# EAGLE design sensor_board_v0.6 (EAGLE 7.6.0)
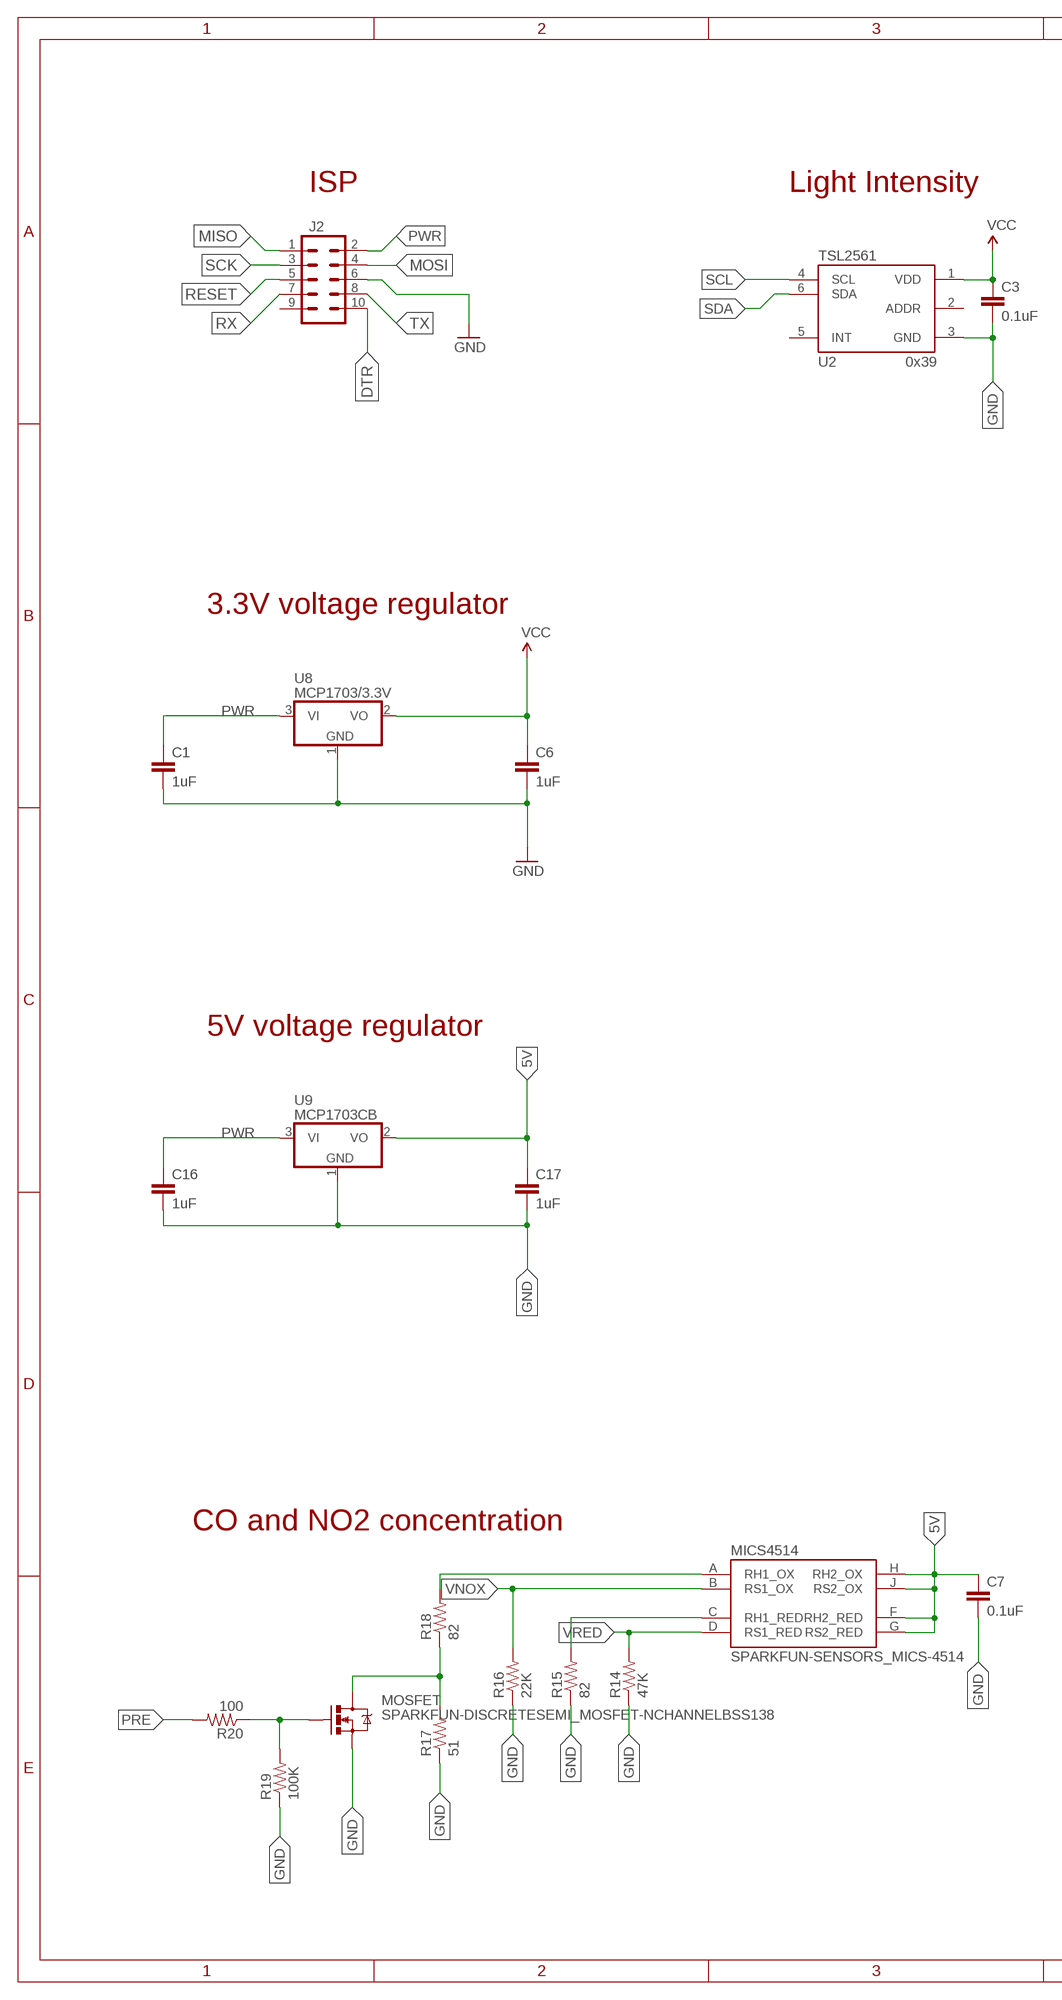
[diagram p0: schematic, sheet 1, part 1 of 2]
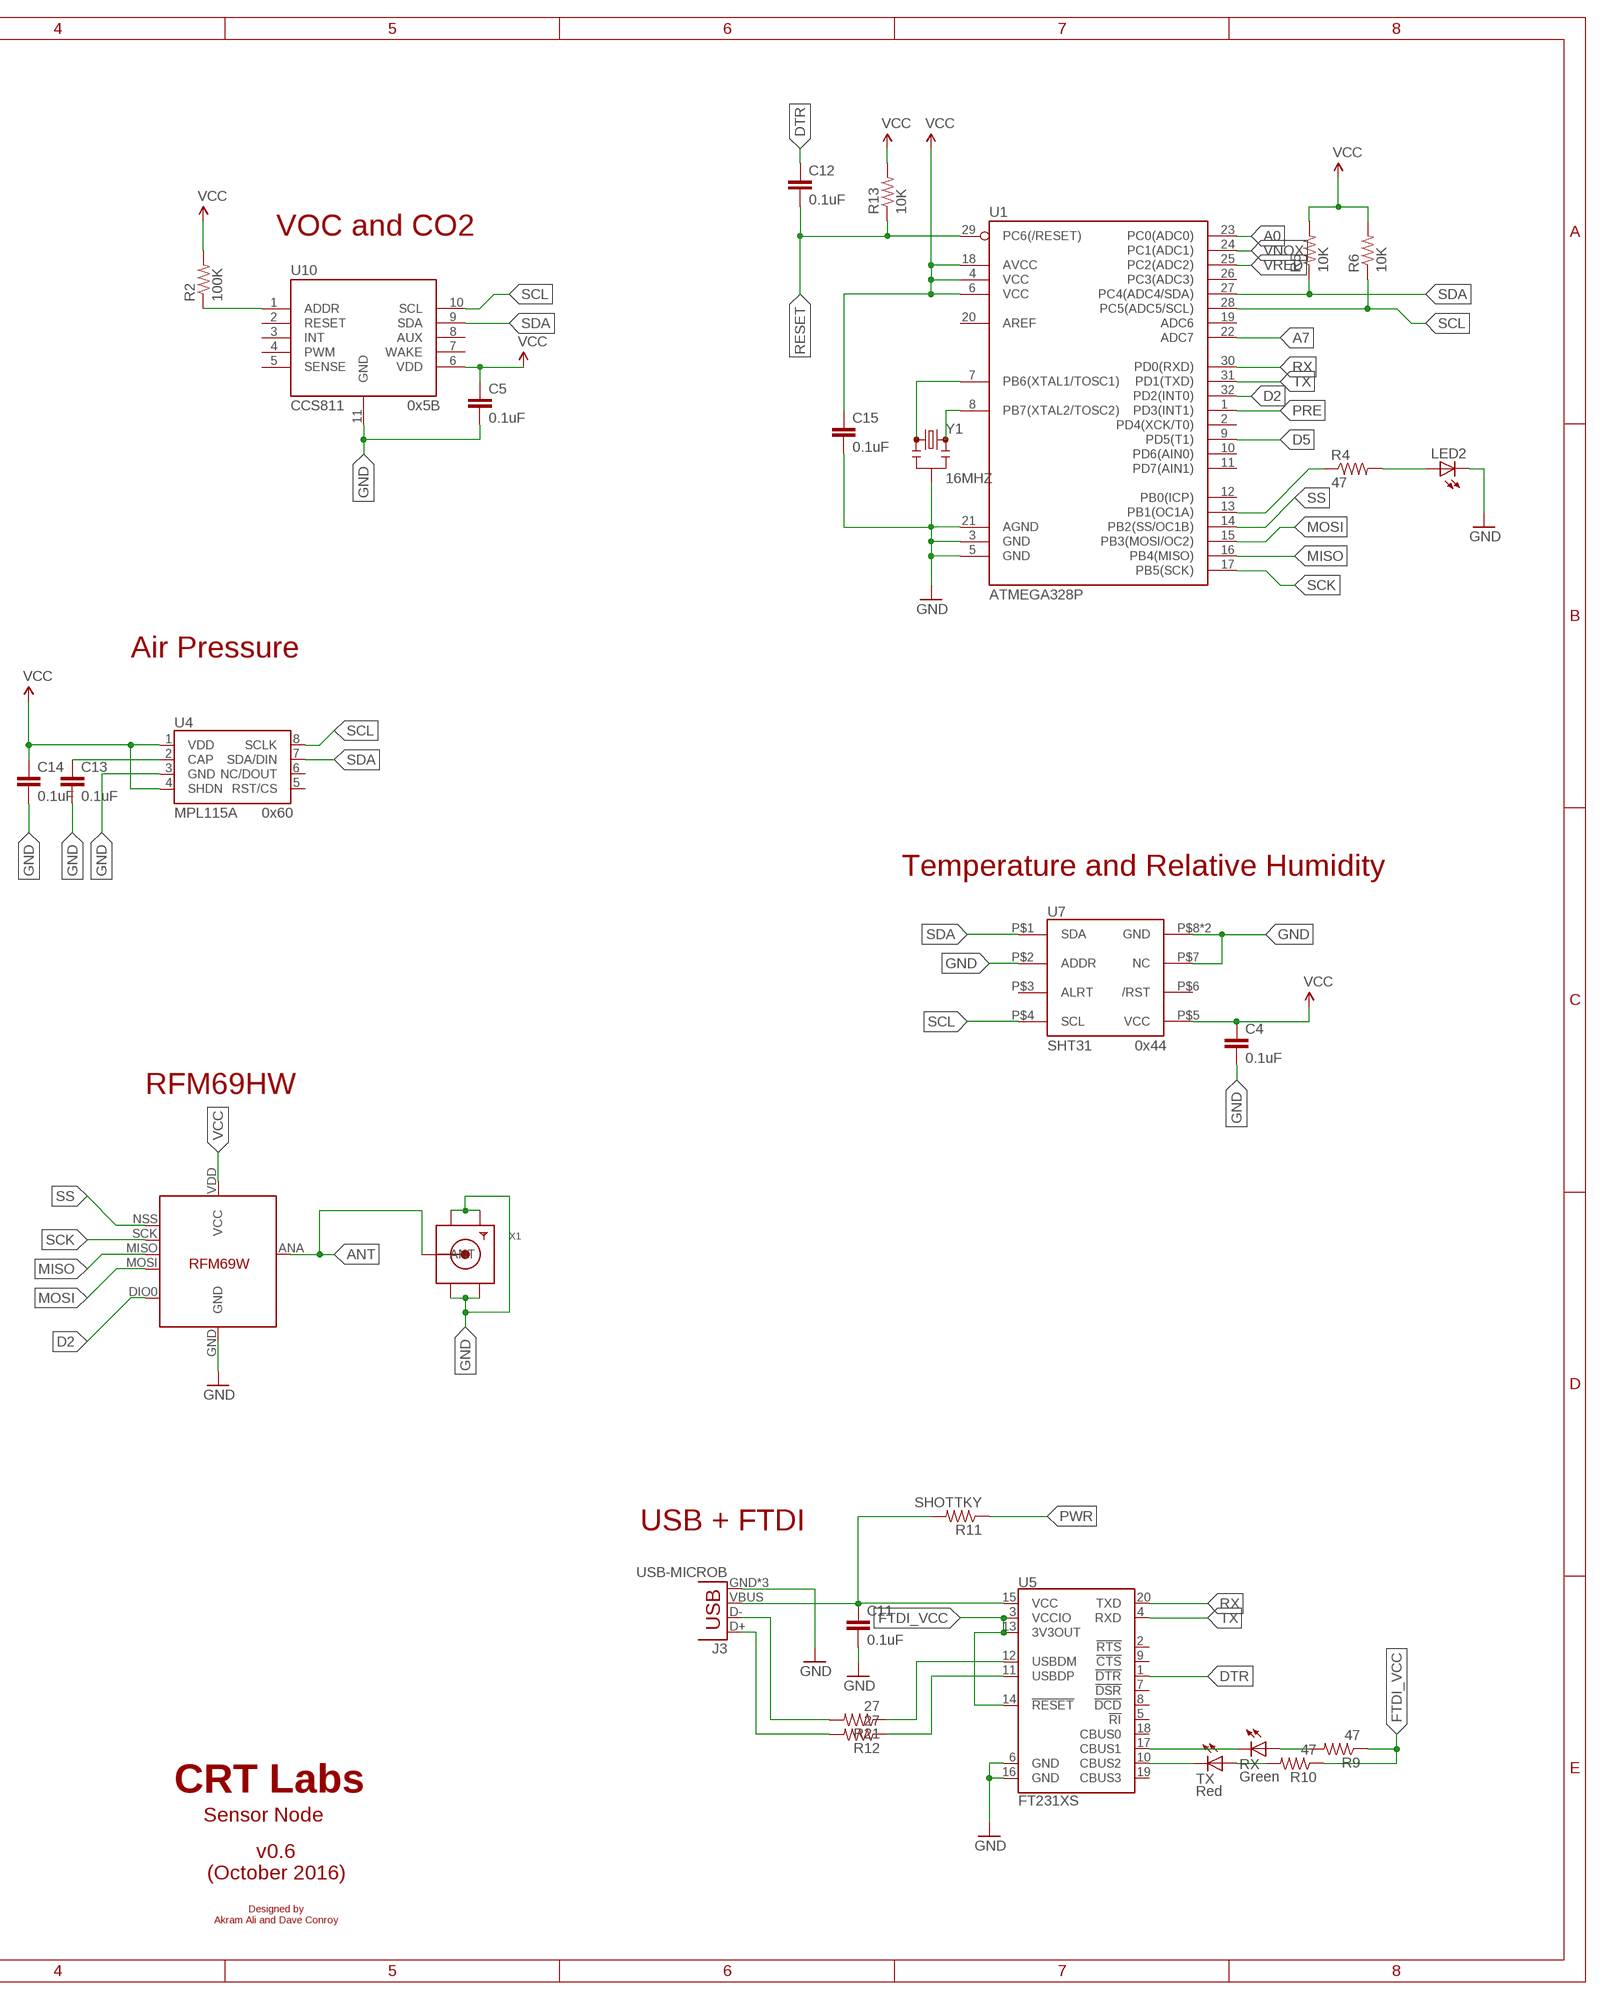
[diagram p1: schematic, sheet 1, part 2 of 2]

## Parts
C1  1uF  CAP0805  [0805]
C3  0.1uF  CAP0805  [0805]
C4  0.1uF  CAP0805  [0805]
C5  0.1uF  CAP0805  [0805]
C6  1uF  CAP0805  [0805]
C7  0.1uF  CAP0805  [0805]
C11  0.1uF  CAP0805  [0805]
C12  0.1uF  CAP0805  [0805]
C13  0.1uF  CAP0805  [0805]
C14  0.1uF  CAP0805  [0805]
C15  0.1uF  CAP0805  [0805]
C16  1uF  CAP0805  [0805]
C17  1uF  CAP0805  [0805]
J2  M05X2PTH  [AVR_ICSP]
J3  USB-MICROB  [USB-MICROB]
LED2  LEDCHIPLED_0805  [CHIPLED_0805]
MICS4514  SPARKFUN-SENSORS_MICS-4514  [SPARKFUN-SENSORS_MICS_10-SMD]
MOSFET  SPARKFUN-DISCRETESEMI_MOSFET-NCHANNELBSS138  [SPARKFUN-DISCRETESEMI_SOT23-3]
R2  100K  RESISTOR0805-RES  [0805]
R4  47  RESISTOR0805-RES  [0805]
R5  10K  RESISTOR0805-RES  [0805]
R6  10K  RESISTOR0805-RES  [0805]
R9  47  RESISTOR0805-RES  [0805]
R10  47  RESISTOR0805-RES  [0805]
R11  SHOTTKY  RESISTOR0805-RES  [0805]
R12  27  RESISTOR0805-RES  [0805]
R13  10K  RESISTOR0805-RES  [0805]
R14  47K  RESISTOR0805-RES  [0805]
R15  82  RESISTOR0805-RES  [0805]
R16  22K  RESISTOR0805-RES  [0805]
R17  51  RESISTOR0805-RES  [0805]
R18  82  RESISTOR0805-RES  [0805]
R19  100K  RESISTOR0805-RES  [0805]
R20  100  RESISTOR0805-RES  [0805]
R21  27  RESISTOR0805-RES  [0805]
RX  Green  LEDCHIPLED_0805  [CHIPLED_0805]
TX  Red  LEDCHIPLED_0805  [CHIPLED_0805]
U1  ATMEGA328P  ATMEGA328P_TQFP  [TQFP32-08]
U2  TSL2561  TSL2561FN  [FN-6]
U4  MPL115A  [LGA8]
U5  FT231XS  [SSOP20_L]
U7  SHT31  SHT31-DIS  [SHT3X]
U8  MCP1703/3.3V  MCP1703CB  [SOT23]
U9  MCP1703CB  [SOT23]
U10  CCS811  CCS811-I2C  [LGA]
U11  RFM69HW  LOWPOWERLAB_RFM69  [LOWPOWERLAB_RFM69W-MINPADS]
X1  SMACONNECTOR_EDGE  [SMA_EDGELAUNCH]
Y1  16MHZ  RESONATOR16MHZ  [RESONATOR-SMD]

## Nets
5V: C7.1 C17.1 MICS4514.F(RH2_RED) MICS4514.G(RS2_RED) MICS4514.H(RH2_OX) MICS4514.J(RS2_OX) U9.2(VO)
A0: U1.23(PC0(ADC0))
A7: U1.22(ADC7)
ANT: U11.ANA(ANT) X1.P(ANT)
D2: U1.32(PD2(INT0)) U11.DIO0
D5: U1.9(PD5(T1))
DTR: C12.1 J2.10 U5.1(!DTR)
FTDI_VCC: R9.1 R10.1 U5.3(VCCIO) U5.13(3V3OUT) U5.14(!RESET)
GND: C1.2 C3.2 C4.2 C5.2 C6.2 C7.2 C11.2 C13.2 C14.2 C15.2 C16.2 C17.2 J2.6 J3.GND J3.MT1(GND) J3.MT2(GND) LED2.C MOSFET.2(S) R14.1 R15.1 R16.1 R17.1 R19.1 U1.3(GND) U1.5(GND) U1.21(AGND) U2.3(GND) U4.3(GND) U5.6(GND) U5.16(GND) U7.P$2(ADDR) U7.P$7(NC) U7.P$8(GND) U7.PAD(GND) U8.1(GND) U9.1(GND) U10.11(GND) U11.GND X1.GND@1(GND4) X1.GND@2(GND3) X1.GND@3(GND2) X1.GND@4(GND1) Y1.2
MISO: J2.1 U1.16(PB4(MISO)) U11.MISO
MOSI: J2.4 U1.15(PB3(MOSI/OC2)) U11.MOSI
N$1: R2.1 U10.1(ADDR)
N$2: R4.1 U1.13(PB1(OC1A))
N$3: LED2.A R4.2
N$4: U1.8(PB7(XTAL2/TOSC2)) Y1.3
N$5: U1.7(PB6(XTAL1/TOSC1)) Y1.1
N$8: MICS4514.A(RH1_OX) R18.2
N$12: C13.1 U4.2(CAP)
N$13: MICS4514.C(RH1_RED) R15.2
N$17: RX.C U5.17(CBUS1)
N$18: TX.C U5.10(CBUS2)
N$20: MOSFET.3(D) R17.2 R18.1
N$23: MOSFET.1(G) R19.2 R20.1
N$25: R21.1 U5.12(USBDM)
N$26: R12.1 U5.11(USBDP)
N$27: R9.2 RX.A
N$29: R10.2 TX.A
N$32: J3.D- R21.2
N$33: J3.D+ R12.2
PRE: R20.2 U1.1(PD3(INT1))
PWR: C1.1 C16.1 J2.2 R11.1 U8.3(VI) U9.3(VI)
RESET: C12.2 J2.5 R13.1 U1.29(PC6(/RESET))
RX: J2.7 U1.30(PD0(RXD)) U5.20(TXD)
SCK: J2.3 U1.17(PB5(SCK)) U11.SCK
SCL: R6.1 U1.28(PC5(ADC5/SCL)) U2.4(SCL) U4.8(SCLK) U7.P$4(SCL) U10.10(SCL)
SDA: R5.1 U1.27(PC4(ADC4/SDA)) U2.6(SDA) U4.7(SDA/DIN) U7.P$1(SDA) U10.9(SDA)
SS: U1.14(PB2(SS/OC1B)) U11.NSS(SEL)
TX: J2.8 U1.31(PD1(TXD)) U5.4(RXD)
VBUS: C11.1 J3.VBUS R11.2 U5.15(VCC)
VCC: C3.1 C4.1 C5.1 C6.1 C14.1 C15.1 R2.2 R5.2 R6.2 R13.2 U1.4(VCC) U1.6(VCC) U1.18(AVCC) U2.1(VDD) U4.1(VDD) U4.4(SHDN) U7.P$5(VCC) U8.2(VO) U10.6(VDD) U11.VDD(VCC)
VNOX: MICS4514.B(RS1_OX) R16.2 U1.24(PC1(ADC1))
VRED: MICS4514.D(RS1_RED) R14.2 U1.25(PC2(ADC2))
Unconnected: J2.9 U1.2(PD4(XCK/T0)) U1.10(PD6(AIN0)) U1.11(PD7(AIN1)) U1.12(PB0(ICP)) U1.19(ADC6) U1.20(AREF) U1.26(PC3(ADC3)) U2.2(ADDR) U2.5(INT) U4.5(RST/CS) U4.6(NC/DOUT) U5.2(!RTS) U5.5(!RI) U5.7(!DSR) U5.8(!DCD) U5.9(!CTS) U5.18(CBUS0) U5.19(CBUS3) U7.P$3(ALRT) U7.P$6(/RST) U10.2(RESET) U10.3(INT) U10.4(PWM) U10.5(SENSE) U10.7(WAKE) U10.8(AUX)

## Notes on the sheet
- ISP | Light Intensity
- VOC and CO2
- 0x39
- 0x5B
- 3.3V voltage regulator
- Air Pressure
- 0x60
- Temperature and Relative Humidity
- 5V voltage regulator
- 0x44
- RFM69HW
- CO and NO2 concentration | USB + FTDI
- CRT Labs
- Sensor Node
- v0.6
  (October 2016)
- Designed by
  Akram Ali and Dave Conroy

## Library data of the parts
C1 C6 C11 C16 C17 = SparkFun-Capacitors:CAP: Capacitor Standard 0603 ceramic capacitor, and 0.1" leaded capacitor.; OC_NEWARK: unknown
C3-C5 C7 = SparkFun-Passives:CAP: Capacitor Standard 0603 ceramic capacitor, and 0.1" leaded capacitor.; OC_NEWARK: unknown
C12-C15 = SparkFun-Passives:CAP: Capacitor Standard 0603 ceramic capacitor, and 0.1" leaded capacitor.
J2 = SparkFun-Connectors:M05X2: Header 5x2 Standard 10-pin dual row 0.1" header. Commonly used with AVR-ISP. Use with Spark Fun Electronics SKU: PRT-00778
J3 = SparkFun-Connectors:USB: USB Connectors USB-B-PTH is fully proven SKU : PRT-00139/CONN-08278 USB-miniB is fully proven SKU : PRT-00587 USB-A-PCB is untested. USB-A-H is throughly reviewed, but untested. Spark Fun Electronics SKU : PRT-00437 USB-B-SMT is throughly reviewed, but untested. Needs silkscreen touching up. USB-A-S has not been used/tested USB-MB-H has not been used/tested USB-MICROB has been used. CONN-09505; PROD_ID: CONN-09505
LED2 RX TX = adafruit:LED: LED OSRAM: - CHIPLED LG R971, LG N971, LY N971, LG Q971, LY Q971, LO R971, LY R971 LH N974, LH R974 LS Q976, LO Q976, LY Q976 LO Q996 - Hyper CHIPLED LW Q18S LB Q993, LB Q99A, LB R99A - SideLED LS A670, LO A670, LY A670, LG A670, LP A670 LB A673, LV A673, LT A673, LW A673 LH A674 LY A675 LS A676, LA A676, LO A676, LY A676, LW A676 LS A679, LY A679, LG A679 - Hyper Micro SIDELED® LS Y876, LA Y876, LO Y876, LY Y876 LT Y87S - SmartLED LW L88C, LW L88S LB L89C, LB L89S, LG L890 LS L89K, LO L89K, LY L89K LS L896, LA L896, LO L896, LY L896 - TOPLED LS T670, LO T670, LY T670, LG T670, LP T670 LSG T670, LSP T670, LSY T670, LOP T670, LYG T670 LG T671, LOG T671, LSG T671 LB T673, LV T673, LT T673, LW T673 LH T674 LS T676, LA T676, LO T676, LY T676, LB T676, LH T676, LSB T676, LW T676 LB T67C, LV T67C, LT T67C, LS T67K, LO T67K, LY T67K, LW E67C LS E67B, LA E67B, LO E67B, LY E67B, LB E67C, LV E67C, LT E67C LW T67C LS T679, LY T679, LG T679 LS T770, LO T770, LY T770, LG T770, LP T770 LB T773, LV T773, LT T773, LW T773 LH T774 LS E675, LA E675, LY E675, LS T675 LS T776, LA T776, LO T776, LY T776, LB T776 LHGB T686 LT T68C, LB T68C - Hyper Mini TOPLED® LB M676 - Mini TOPLED Santana® LG M470 LS M47K, LO M47K, LY M47K Source: http://www.osram.convergy.de/; OC_NEWARK: unknown
MICS4514 = MICS-4514_CO_and_NOx_Sensor_Breakout:SPARKFUN-SENSORS_MICS-4514: Metal oxide MEMS carbon monoxide (CO) and NOx sensor in an SMD package.; PROD_ID: COMP-12310
MOSFET = MICS-4514_CO_and_NOx_Sensor_Breakout:SPARKFUN-DISCRETESEMI_MOSFET-NCHANNEL: Common NMOSFET Parts MFG P/N Store ID Prod ID FDD8780 TRANS-09984 SI7820DN TRANS-11055 FDS6630A IC-08089 2N7002PW TRANS-11151 FQP30N06L COM-10213 TRANS-10060 BSS123LT1G TRANS-08345 BSS138 TRANS-00830 BS170 2N7000; PROD_ID: TRANS-00830
R2 R9-R12 R14-R21 = SparkFun-Passives:RESISTOR: Resistor Basic schematic elements and footprints for 0603, 1206, and PTH resistors.; OC_NEWARK: unknown
R4-R6 = SparkFun-Resistors:RESISTOR: Resistor Basic schematic elements and footprints for 0603, 1206, and PTH resistors.; OC_NEWARK: unknown
R13 = SparkFun-Passives:RESISTOR: Resistor Basic schematic elements and footprints for 0603, 1206, and PTH resistors.
U1 = SparkFun-DigitalIC:ATMEGA328P_TQFP; MPN: ATMEGA328PB-AU; OC_NEWARK: 58Y6083; PROD_ID: IC-09069; VALUE: ATMEGA328P_TQFP
U2 = SparkFun-DigitalIC:TSL2561: TSL2561 illumination sensor Approximates Human Eye Response Precisely Measures Illuminance Programmable Interrupt Function with User-Defined Upper and Lower Threshold 400 KHz I2C interface Programmable Analog Gain and Integration Time Supporting 1,000,000-to-1 Dynamic Range Automatically Rejects 50/60-Hz Lighting Ripple Low Active Power (0.75 mW Typical) with Power Down Mode RoHS Compliant The TSL2561 is a light-to-digital converter that transform light intensity to a digital signal output via I2C interface. The device combines one broadband photodiode (visible plus infrared) and one infrared-responding photodiode on a single CMOS integrated circuit capable of providing a near-photopic response over an effective 20-bit dynamic range (16-bit resolution). Two integrating ADCs convert the photodiode currents to a digital output that represents the irradiance measured on each channel. This digital output can be input to a microprocessor where illuminance (ambient light level) in lux is derived using an empirical formula to approximate the human eye response. The TSL2561 device supports a traditional level style interrupt that remains asserted until the firmware clears it.; DIGIKEY#: TSL2561-FNCT-ND; MANF: AMS-TAOS-USA-Inc.; MANF#: TSL2561FN; MOUSER#: 856-TSL2561T; MPN: TSL2561FN; OC_NEWARK: 82Y5564; PROD_ID: IC-11791
U4 = SparkFun-Sensors:MPL115A: MPL115A1 (SPI) and MPL115A2 (I2C) Miniature Digital Barometer 5.0x3.0x1.2mm LGA Package
U5 = SparkFun-DigitalIC:FT231X: FTDI FT231X Full Speed USB to Full-handshake UART This USB2.0 Full Speed IC offers a compact bridge to full handshake UART interfaces. The device is a UART, capable of operating up to 3MBaud, with low power consumption (8mA). The FT231X includes the complete FT-X series feature set and enables USB to be added into a system design quickly and easily over a UART interface.; PROD_ID: IC-11524
U7 = thomasb9511:SHT31-DIS; MPN: SHT31-DIS-B; OC_NEWARK: 47Y1304
U8 U9 = linear:MCP1703: 250 mA, 16V, Low Quiescent Current LDO Regulator Source: http://ww1.microchip.com/downloads/en/DeviceDoc/22049b.pdf; MPN: MCP1703T-2502E/CB; OC_NEWARK: 18T9177
U10 = CCS811:CCS811
U11 = RFM69 USB Gateway:LOWPOWERLAB_RFM69
X1 = adafruit:SMACONNECTOR: SMA Connector 90° DIP SMA Connector, 50 Ohm (4UConnector: 07259)
Y1 = SparkFun-FreqCtrl:RESONATOR: Resonator Small SMD resonator. Used, eg, on the Arduino Pro/ Pro Mini boards. 8MHz- XTAL-08895 16MHz- XTAL-08900; OC_NEWARK: unknown; PROD_ID: XTAL-08900

## Board
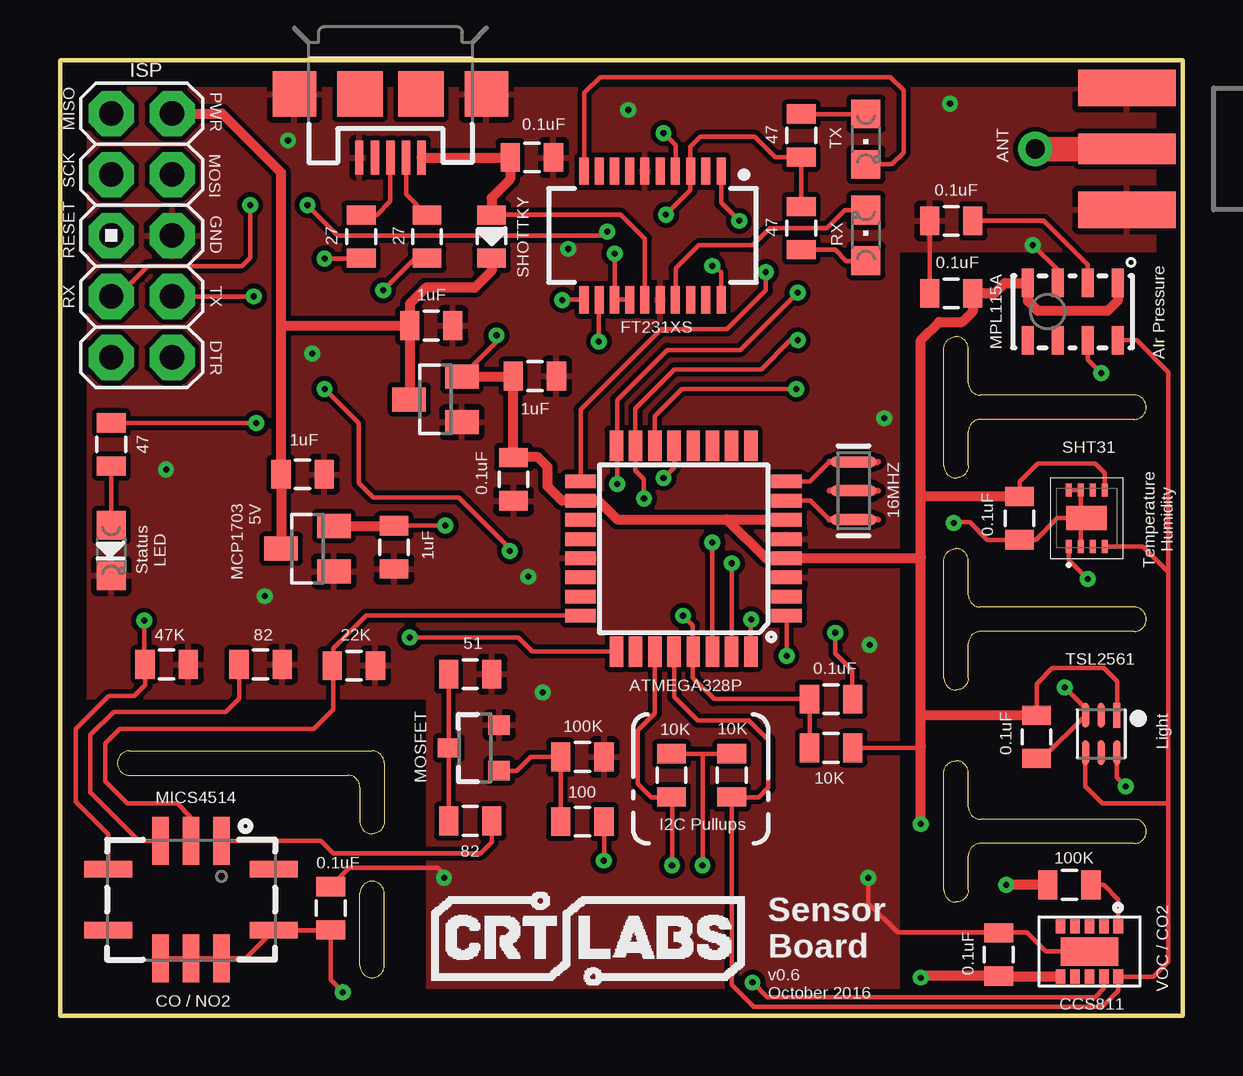
[diagram p2: board, top side]
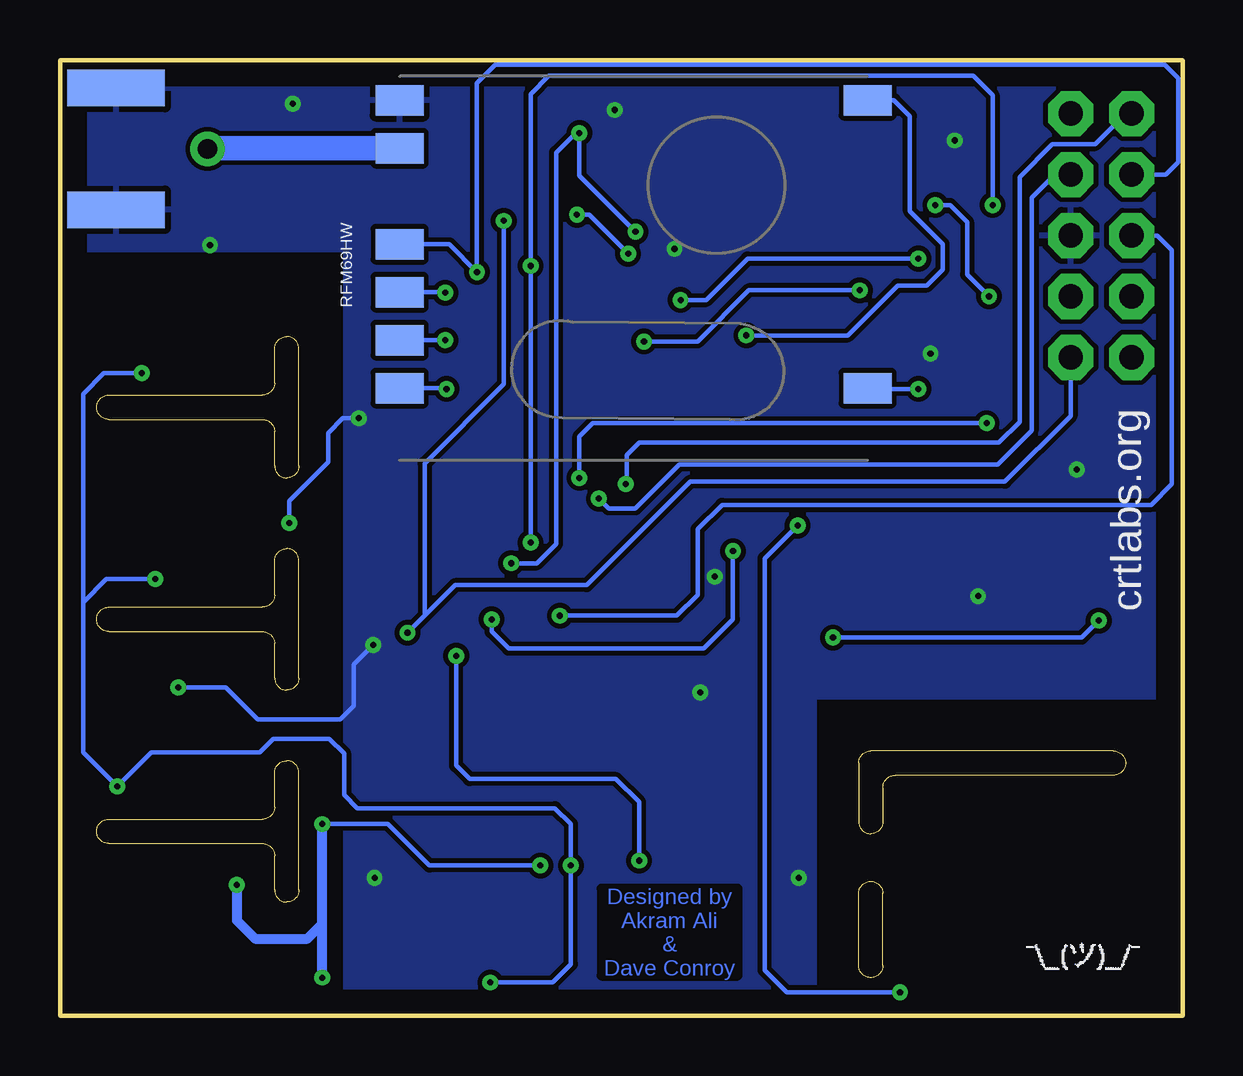
[diagram p3: board, bottom side, seen from below]

Size 46.79 x 39.85 mm. Coordinates in mm from the lower left corner, seen from the top.
Outline: 0.03,39.85 46.79,39.85 46.79,0 0,0 0,39.83
Outline: 44.76,8.2 38.35,8.2 arc-90 37.85,8.71 37.85,10.13 arc90 37.34,10.64 arc90 36.83,10.13 36.83,5.26 arc90 37.34,4.75 arc90 37.85,5.26 37.85,6.68 arc-90 38.35,7.19 44.76,7.19 arc90 45.26,7.7 arc90 44.76,8.2
Outline: 44.76,17.04 38.35,17.04 arc-90 37.85,17.55 37.85,18.97 arc90 37.34,19.48 arc90 36.83,18.97 36.83,14.1 arc90 37.34,13.59 arc90 37.85,14.1 37.85,15.52 arc-90 38.35,16.03 44.76,16.03 arc90 45.26,16.54 arc90 44.76,17.04
Outline: 44.76,25.88 38.35,25.88 arc-90 37.85,26.39 37.85,27.81 arc90 37.34,28.32 arc90 36.83,27.81 36.83,22.94 arc90 37.34,22.43 arc90 37.85,22.94 37.85,24.36 arc-90 38.35,24.87 44.76,24.87 arc90 45.26,25.37 arc90 44.76,25.88
Outline: 2.9,10.03 11.99,10.03 arc-90 12.5,9.52 12.5,8.1 arc90 13.01,7.59 arc90 13.51,8.1 13.51,10.54 arc90 13.01,11.05 2.9,11.05 arc90 2.39,10.54 arc90 2.9,10.03
Outline: 13.51,2.11 13.51,5.11 arc90 13.01,5.61 arc90 12.5,5.11 12.5,2.11 arc90 13.01,1.6 arc90 13.51,2.11
Copper layers (1*16): Top 0.035mm / dielectric 1.5mm / Bottom 0.035mm
Design rules "default": minimum track width 10mil, minimum drill 24mil, track to track 8mil, track to pad 8mil, pad to pad 8mil, via to via 8mil, smd to smd 8mil, copper to edge 40mil, drill to drill 8mil, minimum pad ring 10mil, minimum via ring 8mil, stop-mask expansion 4mil, vias tented up to drill 0mil, thermal gap 10mil

### Footprints (pad centres in the part's own frame; a part is rotated, then mirrored left to right if it is on the bottom)
0805 = smd 0.8 x 1.2: 1 -0.9,0; 2 0.9,0
AVR_ICSP = drill 1.016 pad 1.88 octagon: 1 -1.27,5.08; 2 1.27,5.08; 3 -1.27,2.54; 4 1.27,2.54; 5 -1.27,0; 6 1.27,0; 7 -1.27,-2.54; 8 1.27,-2.54; 9 -1.27,-5.08; 10 1.27,-5.08
USB-MICROB = smd 0.35 x 1.4: D+ 0,2.65; D- -0.65,2.65; GND 1.3,2.65; ID 0.65,2.65; VBUS -1.3,2.65 | smd 1.8 x 1.9: MT1 -4,0; MT2 4,0 | smd 1.9 x 1.9: P$1 -1.27,0; P$2 1.27,0
CHIPLED_0805 = smd 1.2 x 1.2: A 0,-1.05; C 0,1.05
SPARKFUN-SENSORS_MICS_10-SMD = smd 0.7 x 2: A 1.27,2.45; B 0,2.45; C -1.27,2.45; F -1.27,-2.45; G 0,-2.45; H 1.27,-2.45 | smd 2 x 0.7: D -3.45,1.27; E -3.45,-1.27; J 3.45,-1.27; K 3.45,1.27
SPARKFUN-DISCRETESEMI_SOT23-3 = smd 0.8 x 0.9: 1 -0.95,-1; 2 0.95,-1; 3 0,1.1
TQFP32-08 = smd 1.27 x 0.559: 1 -4.293,2.8; 2 -4.293,2; 3 -4.293,1.2; 4 -4.293,0.4; 5 -4.293,-0.4; 6 -4.293,-1.2; 7 -4.293,-2; 8 -4.293,-2.8; 17 4.293,-2.8; 18 4.293,-2; 19 4.293,-1.2; 20 4.293,-0.4; 21 4.293,0.4; 22 4.293,1.2; 23 4.293,2; 24 4.293,2.8 | smd 0.559 x 1.27: 9 -2.8,-4.293; 10 -2,-4.293; 11 -1.2,-4.293; 12 -0.4,-4.293; 13 0.4,-4.293; 14 1.2,-4.293; 15 2,-4.293; 16 2.8,-4.293; 25 2.8,4.293; 26 2,4.293; 27 1.2,4.293; 28 0.4,4.293; 29 -0.4,4.293; 30 -1.2,4.293; 31 -2,4.293; 32 -2.8,4.293
FN-6 = smd 1.05 x 0.3: 1 -0.775,0.65; 2 -0.775,0; 3 -0.775,-0.65; 4 0.775,-0.65; 5 0.775,0; 6 0.775,0.65
LGA8 = smd 1.2 x 0.5: 1 -1.2,1.875; 2 -1.2,0.625; 3 -1.2,-0.625; 4 -1.2,-1.875; 5 1.2,-1.875; 6 1.2,-0.625; 7 1.2,0.625; 8 1.2,1.875
SSOP20_L = smd 0.381 x 1.143: 1 -2.857,-2.68; 2 -2.223,-2.68; 3 -1.587,-2.68; 4 -0.953,-2.68; 5 -0.318,-2.68; 6 0.318,-2.68; 7 0.953,-2.68; 8 1.587,-2.68; 9 2.223,-2.68; 10 2.857,-2.68; 11 2.857,2.68; 12 2.223,2.68; 13 1.587,2.68; 14 0.953,2.68; 15 0.318,2.68; 16 -0.318,2.68; 17 -0.953,2.68; 18 -1.587,2.68; 19 -2.223,2.68; 20 -2.857,2.68
SHT3X = smd 0.55 x 0.25: P$1 -1.175,0.75; P$2 -1.175,0.25; P$3 -1.175,-0.25; P$4 -1.175,-0.75; P$5 1.175,-0.75; P$6 1.175,-0.25; P$7 1.175,0.25; P$8 1.175,0.75 | smd 1 x 1.7: PAD 0,0
SOT23 = smd 1 x 1.4: 1 -0.95,-1.1; 2 0.95,-1.1; 3 0,1.1
LGA = smd 0.6 x 0.4: 1 0.3,3.2; 2 0.3,2.6; 3 0.3,2; 4 0.3,1.4; 5 0.3,0.8; 6 2.4,0.8; 7 2.4,1.4; 8 2.4,2; 9 2.4,2.6; 10 2.4,3.2 | smd 1.2 x 2.4: 11 1.35,2
LOWPOWERLAB_RFM69W-MINPADS = smd 2 x 1.27: ANA 8,-5; DIO0 -11.5,5; GND 8,-7; MISO 8,1; MOSI 8,3; NSS 8,5; SCK 8,-1; VDD -11.5,-7
SMA_EDGELAUNCH = smd 4.064 x 1.524: GND@1 2.032,-2.54; GND@2 2.032,2.54 | smd 4.064 x 1.524 bottom: GND@3 2.032,2.54; GND@4 2.032,-2.54 | smd 4.064 x 1.27: P 2.032,0
RESONATOR-SMD = smd 0.45 x 1.905: 1 -1.2,0; 2 0,0; 3 1.2,0

### Placement (x,y rotation side)
C1  15.47,28.78 0 top
C3  40.69,11.63 270 top
C4  39.98,20.75 270 top
C5  39.12,2.57 90 top
C6  19.79,26.67 0 top
C7  11.28,4.5 90 top
C11  19.66,35.79 0 top
C12  32.13,13.21 180 top
C13  37.13,33.15 180 top
C14  37.13,30.12 180 top
C15  18.9,22.38 270 top
C16  10.11,22.58 0 top
C17  13.92,19.53 270 top
J2  3.4,32.54 0 top
J3  13.77,38.43 180 top
LED2  2.13,19.41 180 top
MICS4514  5.46,4.85 0 top
MOSFET  17.3,11.18 90 top
R2  42.06,5.46 180 top
R4  2.13,23.83 270 top
R5  25.48,10.03 90 top
R6  27.99,10.03 90 top
R9  30.89,32.84 270 top
R10  30.89,36.7 90 top
R11  17.98,32.49 90 top
R12  12.55,32.49 90 top
R13  32.13,11.18 0 top
R14  4.44,14.66 180 top
R15  8.36,14.66 180 top
R16  12.24,14.61 180 top
R17  17.09,14.25 180 top
R18  17.09,8.13 0 top
R19  21.77,10.79 180 top
R20  21.77,8.1 0 top
R21  15.29,32.49 90 top
RX  33.58,32.54 0 top
TX  33.58,36.55 180 top
U1  25.98,19.48 180 top
U2  43.38,11.76 270 top
U4  42.19,29.36 270 top
U5  24.69,32.54 180 top
U7  42.77,20.75 90 top
U8  15.65,25.7 90 top
U9  10.31,19.48 90 top
U10  40.89,4.04 270 top
U11  24.64,31.17 180 bottom
X1  46.48,36.14 180 top
Y1  33.07,21.89 90 top

### Tracks (layer width: path | path; a pad name or v marks a point on that pad's centre or on a via)
5V  (via drill 0.25 pad 0.13)
  Top 0.178: 8.89,3.56 MICS4514.J | MICS4514.F MICS4514.G MICS4514.H 7.73,2.4 MICS4514.J | MICS4514.J 11.26,3.58 C7.1 11.28,1.5 v11.79,0.99 | v16.05,20.45 13.93,20.45 C17.1
  Top 0.406: U9.2 C17.1
  Bottom 0.178: v11.79,0.99 16.51,0.99 17.42,1.9 17.42,19.08 v16.05,20.45
ANT  (via drill 0.8 pad 1.42)
  Top 1.016: X1.P v40.64,36.14
  Bottom 1.016: U11.ANA 40.62,36.17 v40.64,36.14
D2  (via drill 0.25 pad 0.13)
  Top 0.178: v18.75,19.38 18.75,19.48 16.61,21.62 13.06,21.62 12.45,22.22 12.45,24.71 v11.02,26.14 | v28.8,16.54 28.78,16.52 U1.32
  Bottom 0.178: v18.75,19.38 18.75,16.54 19.96,15.32 28.09,15.32 28.8,16.03 v28.8,16.54 | 13.16,26.15 U11.DIO0 13.11,26.14 v11.02,26.14
DTR  (via drill 0.25 pad 0.13)
  Top 0.178: U5.1 27.55,33.9 v28.3,33.15 | v32.31,15.98 32.31,15.11 33.02,14.4 C12.1
  Bottom 0.178: v28.3,33.15 28.3,26.34 31.6,23.04 31.6,16.69 | 31.6,16.69 31.78,16.51 v32.31,15.98 | J2.10 4.67,25.02 7.42,22.28 20.52,22.28 24.84,17.96 30.33,17.96 31.6,16.69
FTDI_VCC  (via drill 0.25 pad 0.13)
  Top 0.178: U5.14 U5.13 23.11,29.87 v23.11,31.78 | R9.1 R10.1 29.81,35.8 28.96,36.65 26.67,36.65 26.26,36.25 26.26,35.23 | 26.26,35.23 U5.3 | 26.26,35.23 26.26,34.42 v25.25,33.4
  Bottom 0.178: v25.25,33.4 24.74,33.4 v23.11,31.78
GND  (via drill 0.25 pad 0.13)
  Top 0.178: v16,5.77 16,5.92 15.75,6.17 12.05,6.17 C7.2 | U10.11 41.08,2.69 40.28,3.48 39.13,3.48 | 39.13,3.48 C5.2 | 39.13,3.48 34.9,3.48 33.68,4.7 v33.68,5.77 | U7.P$2 42.52,20.5 U7.PAD | U7.P$8 U7.P$7 42.52,21 U7.PAD | U7.PAD 41.55,20.75 40.65,19.85 C4.2 38.64,19.85 37.9,20.6 37.29,20.6 v37.24,20.55 | C3.2 40.93,10.73 U2.3 42.73,12.82 v41.86,13.69 | C14.2 C13.2 | U4.3 41.56,31.1 v40.54,32.13
  Bottom 0.178: v37.24,20.55 37.24,21.46 35.61,23.09 35.61,24.31 35,24.92 v34.34,24.92 | v33.73,15.47 34.54,14.66 34.54,12.93 35.1,12.37 38.56,12.37 39.88,13.69 v41.86,13.69
  other vias: 37.08,38.02 23.67,37.77 8.53,17.5 9.5,36.5 10.52,27.61 19.51,18.31 21.18,31.98 4.42,22.78 20.12,13.49
  pour Top: -0.41,40.31 47.19,40.31 47.19,31.93 34.9,31.93 34.9,-0.58 15.34,-0.58 15.34,13.28 -0.56,13.28 -0.56,40.26
  pour Bottom: -0.41,40.36 47.19,40.36 47.24,31.93 34.9,31.93 34.9,-0.79 15.34,-0.79 15.34,13.28 -0.56,13.28 -0.56,40.31
MISO  (via drill 0.25 pad 0.13)
  Top 0.178: v30.73,30.15 28.35,27.76 25.3,27.76 23.22,25.68 23.22,23.81 U1.16 23.22,23.74 v23.22,22.17
  Bottom 0.178: U11.MISO 30.75,30.17 v30.73,30.15 | J2.1 2.39,37.62 3.66,36.35 5.44,36.35 6.81,34.98 6.81,24.76 7.67,23.9 22.66,23.9 23.17,23.39 23.17,22.12 v23.22,22.17
MOSI  (via drill 0.25 pad 0.13)
  Top 0.178: v30.73,28.17 30.43,28.17 29.21,26.95 25.6,26.95 23.98,25.32 U1.15 23.98,22.73 24.33,22.38 v24.33,21.56
  Bottom 0.178: U11.MOSI v30.74,28.17 v30.73,28.17 | J2.4 5.33,35.08 6.3,34.11 6.3,24.41 7.72,22.99 20.98,22.99 22.81,21.16 23.93,21.16 v24.33,21.56
N$1
  Top 0.178: R2.1 43.49,5.46 44.09,4.85 U10.1 | U10.1
N$2  (via drill 0.25 pad 0.13)
  Top 0.178: U1.13 25.58,22.87 v25.15,22.43 | R4.1 8.17,24.73 v8.18,24.71
  Bottom 0.178: v25.15,22.43 25.15,24.16 24.59,24.71 v8.18,24.71
N$3
  Top 0.178: R4.2 LED2.A
N$4
  Top 0.178: U1.8 31.24,22.28 32.06,23.09
N$5
  Top 0.178: U1.7 31.27,21.48 32.06,20.69
N$8
  Top 0.178: MICS4514.A 10.86,7.3 11.38,6.78 17.53,6.78 17.98,7.24 17.98,8.12 R18.2
N$12
  Top 0.178: C13.1 41,33.15 42.82,31.32 42.82,30.57 U4.2
N$13
  Top 0.178: R15.2 7.47,14.64 7.47,13.23 6.91,12.67 2.24,12.67 1.27,11.71 1.27,9.32 3.29,7.3 MICS4514.C
N$17
  Top 0.178: RX.C 32.7,33.59 31.95,32.84 29.57,32.84 28.85,32.13 26.62,32.13 25.65,31.17 25.65,29.87 U5.17
N$18
  Top 0.178: TX.C 34.66,35.5 35.15,35.99 35.15,38.58 34.6,39.14 22.5,39.14 21.84,38.48 21.84,35.23 U5.10
N$20
  Top 0.178: R18.1 MOSFET.3 R17.2
N$23
  Top 0.178: MOSFET.1 19.04,10.23 19.61,10.79 R19.2 R20.1
N$25  (via drill 0.25 pad 0.13)
  Top 0.178: R21.1 14.8,31.59 v13.46,30.25 | v22.45,28.12 22.45,29.84 U5.12
  Bottom 0.178: v13.46,30.25 18.09,30.25 20.22,28.12 v22.45,28.12
N$26  (via drill 0.25 pad 0.13)
  Top 0.178: U5.11 20.94,29.86 v20.93,29.84 | v11.02,31.57 12.53,31.57 R12.1
  Bottom 0.178: v20.93,29.84 19.86,29.84 18.14,31.57 v11.02,31.57
N$27
  Top 0.178: R9.2 32.29,31.94 32.77,31.47 33.56,31.47 RX.A
N$29
  Top 0.178: TX.A R10.2
N$32
  Top 0.178: J3.D- 14.42,34.26 R21.2
N$33
  Top 0.178: R12.2 13.19,33.39 13.77,33.96 J3.D+
PRE  (via drill 0.25 pad 0.13)
  Top 0.178: R20.2 v22.67,6.49 v22.66,6.48 | v30.28,15.01 U1.1
  Bottom 0.178: v22.66,6.48 22.66,8.92 23.62,9.88 29.72,9.88 30.28,10.44 v30.28,15.01
PWR
  Top 0.406: R11.1 17.98,31.06 17.27,30.35 15.24,30.35 14.58,29.69 14.58,28.79 | 14.58,28.79 C1.1 9.21,28.78 | 14.58,28.79 14.58,25.74 U8.3 | U9.3 C16.1 9.21,28.78 | J2.2 6.76,37.62 9.21,35.16 9.21,28.78
RESET  (via drill 0.25 pad 0.13)
  Top 0.178: R13.1 C12.2 27.25,13.21 26.37,14.1 26.37,15.17 | 26.37,15.17 U1.29 | 26.37,15.17 26.37,16.28 v25.96,16.69
  Bottom 0.178: v25.96,16.69 21.08,16.69 20.22,17.55 20.22,20.29 19.2,21.31 1.32,21.31 0.46,22.17 0.46,31.93 1.07,32.54 J2.5
RX  (via drill 0.25 pad 0.13)
  Top 0.178: U5.20 27.55,31 v27.18,31.27 | U1.30 v27.18,19.73 v27.18,19.74 | J2.7 2.39,30 3.66,31.27 7.57,31.27 7.93,31.62 v7.93,33.81
  Bottom 0.178: v27.18,19.74 v27.18,31.27 27.18,38.43 26.42,39.19 8.74,39.19 7.93,38.38 v7.93,33.81
SCK  (via drill 0.25 pad 0.13)
  Top 0.178: U1.17 21.69,25.27 25.04,28.63 27.79,28.63 29.41,30.25 v29.41,31.01
  Bottom 0.178: U11.SCK 30.57,32.17 v29.41,31.01 29.41,38.89 28.65,39.65 0.76,39.65 0.2,39.09 0.2,35.59 0.71,35.08 J2.3
SCL
  Top 0.178: U1.28 25.58,13.3 26.57,12.32 28.7,12.32 29.52,11.51 29.52,9.52 29.11,9.12 28.01,9.12 R6.1 27.99,1.3 28.91,0.38 43.43,0.38 44.09,1.04 U10.10 45.56,1.64 46.18,2.26 46.18,8.86 | U2.4 42.72,10.97 42.72,9.58 43.43,8.86 46.18,8.86 | U7.P$4 45.12,19.58 46.18,18.52 | 46.18,8.86 46.18,18.52 | 46.18,18.52 46.18,26.85 44.86,28.17 U4.8
SDA  (via drill 0.25 pad 0.13)
  Top 0.178: U1.27 24.78,12.62 24.08,11.91 24.08,9.68 24.64,9.12 25.46,9.12 R5.1 25.5,9.11 v25.5,6.27 | U10.9 43.49,1.15 43.13,0.79 29.46,0.79 v28.85,1.4 | U7.P$1 42.02,19.01 v42.82,18.21 | U4.7 42.81,27.37 v43.38,26.8 | U2.6 44.03,9.94 v44.4,9.58
  Bottom 0.178: v28.85,1.4 26.26,1.4 25.5,2.16 v25.5,6.27 25.5,8 26.16,8.66 34.39,8.66 34.95,9.22 34.95,10.95 35.56,11.56 37.9,11.56 38.46,11 42.98,11 v44.4,9.58 45.82,11 45.82,17.25 | v42.82,18.21 44.86,18.21 45.82,17.25 | v43.38,26.8 44.96,26.8 45.82,25.93 45.82,17.25
SS  (via drill 0.25 pad 0.13)
  Top 0.178: v30.68,26.14 25.91,26.14 24.79,25.02 U1.14
  Bottom 0.178: U11.NSS 30.71,26.17 v30.68,26.14
TX  (via drill 0.25 pad 0.13)
  Top 0.178: U5.4 25.65,35.23 25.65,36.3 v25.15,36.8 | v8.08,30 J2.8 | v10.31,33.81 11.58,32.54 22.66,32.54 v22.81,32.69 | v27.99,18.87 U1.31
  Bottom 0.178: v22.81,32.69 25.15,35.03 v25.15,36.8 25.3,36.8 26.11,35.99 26.11,19.68 26.92,18.87 v27.99,18.87 | v10.31,33.81 9.7,33.81 8.99,33.1 8.99,30.91 v8.08,30
VBUS
  Top 0.178: U5.15 24.37,32.4 23.37,33.4 R11.2
  Top 0.406: J3.VBUS C11.1 18.76,34.89 17.98,34.11 R11.2
VCC  (via drill 0.25 pad 0.13)
  Top 0.178: 39.14,1.64 C5.1 | 35.93,1.67 v35.87,1.6 | C4.1 39.98,22.28 40.74,23.04 43.13,23.04 43.54,22.63 U7.P$5 | 25.49,10.95 R5.2 26.77,10.93 | R6.2 26.77,10.93 | 26.77,10.93 v26.77,6.27 | R13.2 35.79,11.18 35.87,11.25 | C3.1 40.69,13.84 41.35,14.5 43.49,14.5 44.04,13.94 44.04,12.55 U2.1 | v18.19,28.37 18.19,28.09 U8.2
  Top 0.406: U8.2 18.87,26.65 | 18.87,26.65 C6.1 | U10.6 39.14,1.64 | 39.97,21.67 C4.1 35.98,21.65 35.87,21.77 | C3.1 35.87,12.52 | R2.2 v39.42,5.46 | C5.1 35.93,1.67 | v35.87,8 35.87,11.25 35.87,12.52 | 35.87,12.52 35.87,19.13 | 35.87,19.13 35.87,21.77 | 35.87,21.77 35.87,28.17 36.63,28.93 37.59,28.93 38.05,29.39 38.05,30.11 C14.1 38.94,30.12 39.37,30.56 U4.4 40.34,30.54 40.34,29.79 40.74,29.39 43.64,29.39 44.06,29.81 U4.1 | 18.87,26.65 18.87,23.3 C15.1 18.91,23.29 19.91,23.29 20.32,22.89 20.32,22.07 20.91,21.48 U1.18 22.44,21.48 23.22,20.7 27.79,20.7 | 27.79,20.7 30.26,20.7 U1.6 | 27.79,20.7 29.41,19.08 U1.4 35.81,19.08 35.87,19.13
  Bottom 0.178: v26.77,6.27 31.39,6.27 33.12,8 v35.87,8 | v18.19,28.37 13.97,28.37 11.89,30.45 10.67,30.45 10.01,31.11 10.01,32.18 11.38,33.55 11.38,37.52 12.04,38.18 U11.VDD
  Bottom 0.406: v39.42,5.46 39.42,3.99 38.66,3.23 36.47,3.23 35.87,3.84 | 35.87,3.84 v35.87,8 | v35.87,1.6 35.87,3.84
VNOX
  Top 0.178: 11.38,14.57 11.38,12.78 10.57,11.96 2.49,11.96 1.88,11.35 1.88,9.78 2.79,8.86 4.88,8.86 5.44,8.31 5.44,7.33 MICS4514.B | 11.38,14.57 R16.2 | 11.38,14.57 11.38,15.32 12.75,16.69 U1.24
VRED  (via drill 0.25 pad 0.13)
  Top 0.178: MICS4514.D 2.01,7.56 0.66,8.92 0.66,11.96 2.03,13.33 3.1,13.33 3.56,13.79 3.56,14.64 R14.2 3.51,14.7 v3.51,16.48 | U1.25 19.69,15.19 19.1,15.77 v14.58,15.77
  Bottom 0.178: v14.58,15.77 4.22,15.77 v3.51,16.48

### Text on the board
Bottom: Designed by / Akram Ali / & / Dave Conroy
_tsilk: ISP | MISO | TX | PWR | ANT | SCK | MOSI | RX | RESET | GND | RX | TX | AIr Pressure | DTR | MCP1703 / 5V | Temperature / Humidity | Status / LED | Light | I2C Pullups | Sensor / Board | VOC / CO2 | CO / NO2 | v0.6 / October 2016
_bsilk: crtlabs.org